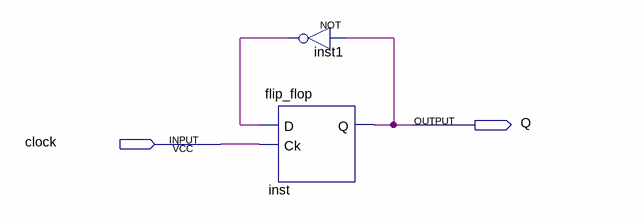
[diagram p0: schematic sheet]
// Quartus schematic xx.bdf as structural Verilog: 2 symbols, 2 pins
module xx (
  input  clock,
  output Q
);

  wire inst1_out;

  not inst1 (inst1_out, Q);
  flip_flop inst (.D(inst1_out), .Ck(clock), .Q(Q));
endmodule
